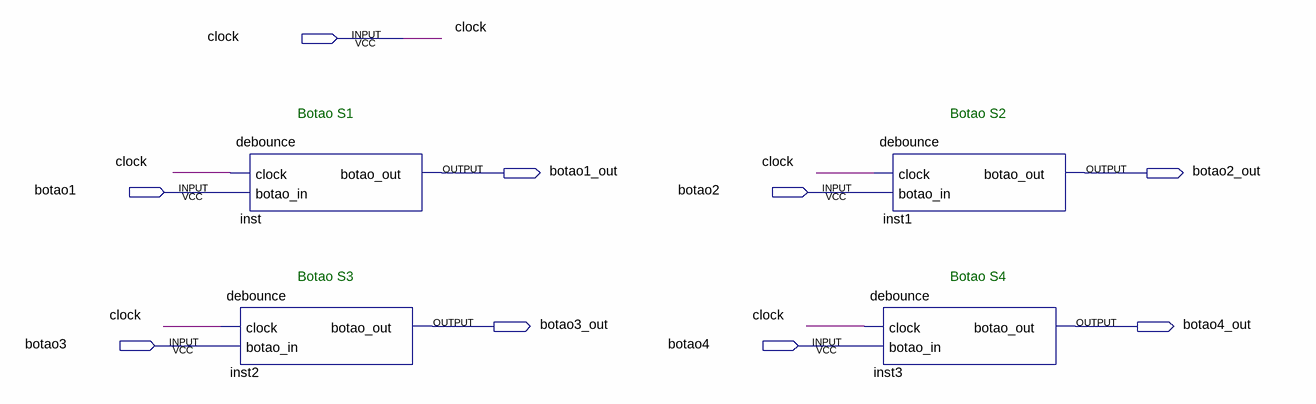
[diagram p0: schematic sheet]
// Quartus schematic bloco_debounce.bdf as structural Verilog: 4 symbols, 9 pins
module bloco_debounce (
  input  clock,
  input  botao1,
  input  botao2,
  input  botao3,
  input  botao4,
  output botao1_out,
  output botao2_out,
  output botao3_out,
  output botao4_out
);

  debounce inst (.clock(clock), .botao_in(botao1), .botao_out(botao1_out));
  debounce inst2 (.clock(clock), .botao_in(botao3), .botao_out(botao3_out));
  debounce inst3 (.clock(clock), .botao_in(botao4), .botao_out(botao4_out));
  debounce inst1 (.clock(clock), .botao_in(botao2), .botao_out(botao2_out));

  // Notes on the sheet:
  //   Botao S1
  //   Botao S2
  //   Botao S3
  //   Botao S4
endmodule
